# Altium project EDR_Project.PrjPcb
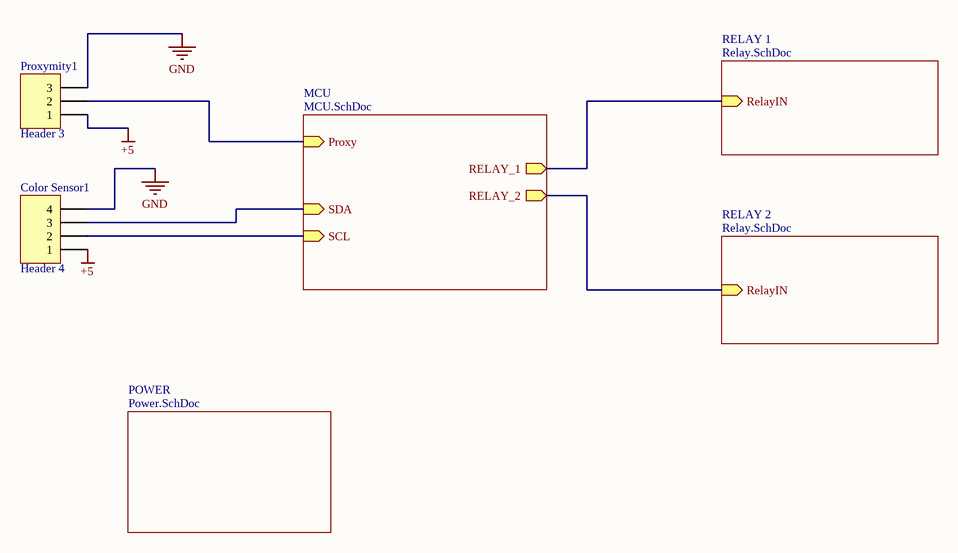
[diagram p0: main.SchDoc]
4 sheets, 27 parts. Net scope: hierarchical (ports join the sheet entries above them; power ports are global).
Sheets:
  main.SchDoc
    MCU = MCU.SchDoc
    RELAY 1 = Relay.SchDoc
    RELAY 2 = Relay.SchDoc
    POWER = Power.SchDoc

## Sheet main.SchDoc
size A; SheetNumber: 1; SheetTotal: 4

### Parts
Color_Sensor1  Header 4  [HDR1X4]
Proxymity1  Header 3  [HDR1X3]

### Sub-sheets
MCU = MCU.SchDoc: RELAY_2 (out), RELAY_1 (out), SDA (in), Proxy (in), SCL (in)
POWER = Power.SchDoc: no entries
RELAY 1 = Relay.SchDoc: RelayIN (in)
RELAY 2 = Relay.SchDoc: RelayIN (in)

### Nets
+5: Color_Sensor1.1 Proxymity1.1
GND: Color_Sensor1.4 Proxymity1.3
NetColor_Sensor1_2: Color_Sensor1.2 ; sheet MCU/SCL
NetColor_Sensor1_3: Color_Sensor1.3 ; sheet MCU/SDA
NetIC1_12: sheet MCU/RELAY_1, sheet RELAY 1/RelayIN
NetIC1_13: sheet MCU/RELAY_2, sheet RELAY 2/RelayIN
NetIC1_24: Proxymity1.2 ; sheet MCU/Proxy

### Library data of the parts
Color_Sensor1 = Header 4: Header, 4-Pin; LatestRevisionDate: 17-Jul-2002; LatestRevisionNote: Re-released for DXP Platform.; Publisher: Altium Limited
Proxymity1 = Header 3: Header, 3-Pin; LatestRevisionDate: 17-Jul-2002; LatestRevisionNote: Re-released for DXP Platform.; Publisher: Altium Limited

## Sheet MCU.SchDoc
size A; SheetNumber: 2; SheetTotal: 4
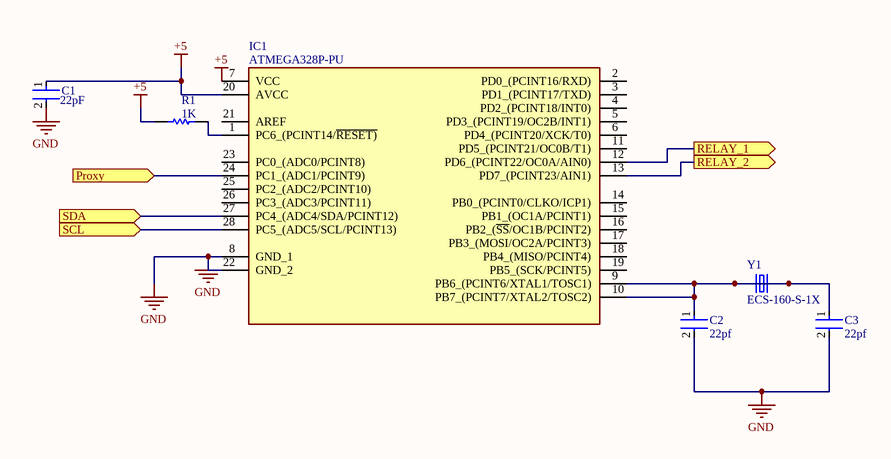
[diagram p1: MCU.SchDoc]

### Parts
C1  22pf  [FP-VY2472M49Y5UG63V7-MFG]
C2  22pf  [FP-VY2472M49Y5UG63V7-MFG]
C3  22pf  [FP-VY2472M49Y5UG63V7-MFG]
IC1  ATMEGA328P-PU  [DIP794W53P254L3467H457Q28N]
R1  1K  [RESA60-630X240]
Y1  ECS-160-S-1X  [XTAL_ECS-160-S-1X]

### Ports
Proxy (in), RELAY_1 (out), RELAY_2 (out), SCL (in), SDA (in)

### Nets
+5: C1.1 IC1.7(VCC) IC1.20(AVCC) R1.1
GND: C1.2 C2.2 C3.2 IC1.8(GND_1) IC1.22(GND_2)
NetC2_1: C2.1 C3.1 IC1.9(PB6_(PCINT6/XTAL1/TOSC1)) IC1.10(PB7_(PCINT7/XTAL2/TOSC2)) Y1.1 Y1.2
NetColor_Sensor1_2: IC1.28(PC5_(ADC5/SCL/PCINT13)) ; port SCL
NetColor_Sensor1_3: IC1.27(PC4_(ADC4/SDA/PCINT12)) ; port SDA
NetIC1_1: IC1.1(PC6_(PCINT14/~{RESET)}) R1.2
NetIC1_12: IC1.12(PD6_(PCINT22/OC0A/AIN0)) ; port RELAY_1
NetIC1_13: IC1.13(PD7_(PCINT23/AIN1)) ; port RELAY_2
NetIC1_24: IC1.24(PC1_(ADC1/PCINT9)) ; port Proxy

Not connected (* = marked no-connect by the designer): IC1 2(PD0_(PCINT16/RXD)) 3(PD1_(PCINT17/TXD)) 4(PD2_(PCINT18/INT0)) 5(PD3_(PCINT19/OC2B/INT1)) 6(PD4_(PCINT20/XCK/T0)) 11(PD5_(PCINT21/OC0B/T1)) 14(PB0_(PCINT0/CLKO/ICP1)) 15(PB1_(OC1A/PCINT1)) 16(PB2_(~{SS}/OC1B/PCINT2)) 17(PB3_(MOSI/OC2A/PCINT3)) 18(PB4_(MISO/PCINT4)) 19(PB5_(SCK/PCINT5)) 21(AREF) 23(PC0_(ADC0/PCINT8)) 25(PC2_(ADC2/PCINT10)) 26(PC3_(ADC3/PCINT11))

### Library data of the parts
C1-C3 = CMP-02417-000047-1: Capacitor Ceramic 4700pF ±20% Y5U BULK RADIAL; Lead/Base Style: Kinked; Capacitance: 4.7nF; Voltage Rating (DC): 300V; Body Diameter: 12.5mm; Lead Diameter: 0.6mm; Dissipation Factor: 2.5%; Mount: Through Hole; Package Quantity: 1000; Packaging: Bulk; Case/Package: Radial; Resistor Type: Ceramic; Termination: Radial; Series: VY2; Dielectric: Y5U; RoHS Compliant: Yes; Weight: 0.040932oz; Height - Seated (Max): 0.65inch; Tolerance: 20%; Lead Pitch: 7.5mm; REACH SVHC: No SVHC; Voltage Rating: 300V; Thickness: 5mm; Diameter: 12.5mm; Voltage Rating (AC): 300V; Max Operating Temperature: 125°C; Min Operating Temperature: -40°C
  C1: value: 22pF
IC1 = ATMEGA328P-PU: Integrated Circuit; Manufacturer_Name: Microchip; Datasheet Link: https://www.mouser.ca/datasheet/2/268/ATmega48A_PA_88A_PA_168A_PA_328_P_DS_DS40002061B-3050139.pdf; Height: 4.572mm; Manufacturer_Part_Number: ATMEGA328P-PU; Mouser Part Number: 556-ATMEGA328P-PU; Mouser Price/Stock: https://www.mouser.co.uk/ProductDetail/Microchip-Technology/ATMEGA328P-PU?qs=K8BHR703ZXguOQv3sKbWcg%3D%3D; Arrow Part Number: ATMEGA328P-PU; Arrow Price/Stock: https://www.arrow.com/en/products/atmega328p-pu/microchip-technology?region=europe
R1 = CMP-1659-00074-2: Axial Resistor, 10 KOhm, +/- 1%, 0.25 W, -55 to 155 degC, 2-Pin THD, RoHS, Bulk; Manufacturer: Yageo; Temperature Coefficient: 100ppm\/degreesC; Voltage Rating: 250V; Voltage Rating (DC): 200V; Resistance: 1KOhm; Max Power Dissipation: 250mW; Datasheet URL: http://www.yageo.com/documents/recent/Yageo%20LR_MFR_2013.pdf; Packaging: Bulk; RoHSCompliant: True; Mount: ThroughHole; Package Reference: MFR-25; Termination: Axial; Composition: MetalFilm; Number of Terminations: 2; Package Quantity: 200; Mounting Technology: ThroughHole; Length: 0.248inch; Max Operating Temperature: 155degC; Min Operating Temperature: -55degC; Datasheet Version: 04/2013; Lead Free: LeadFree; Manufacturer URL: http://www.yageo.com/; Tolerance: 1%; Power Rating: 250mW; Package Description: 2-Pin Axial Lead, Dia 2.4 mm, Body Length 6.3 mm; Military Standard: Not; Case\/Package: Axial
Y1 = ECS-160-S-1X: 16MHz Â±30ppm Crystal Series 20 Ohms HC-49/U; MF: ECS Inc.; Value: *; MP: ECS-160-S-1X; SnapEDA_Link: https://www.snapeda.com/parts/ECS-160-S-1X/ECS%20Inc./view-part/2458894/?ref=snap; Availability: Unavailable; Package: HC49/U ECS International; Price: None

## Sheet Relay.SchDoc
size A; SheetNumber: 4; SheetTotal: 4
Used 2 times, as channels RELAY 1, RELAY 2. Parts and nets are listed once, with the designators drawn on the sheet.
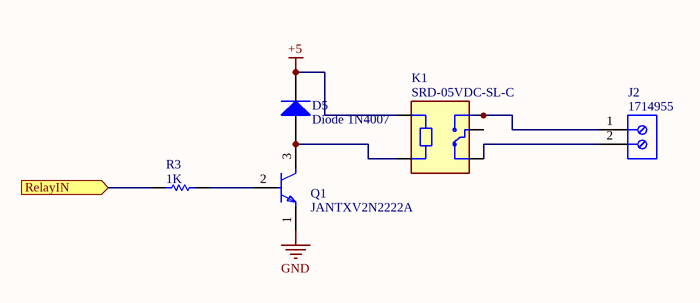
[diagram p2: Relay.SchDoc]

### Parts
D5  Diode 1N4007  [DO-41]
J2  1714955  [PHOE-1714955_V]
K1  SRD-05VDC-SL-C  [RELAY_SRD-05VDC-SL-C]
Q1  JANTXV2N2222A  [FP-TO-18-MFG]
R3  1K  [RESA60-630X240]

### Ports
RelayIN (in)

### Nets
+5: D5.2(K) K1.A1
GND: Q1.1(E)
RelayIN: R3.1 ; port RelayIN
NetD5_1: D5.1(A) K1.A2 Q1.3(C)
NetJ2_1: J2.1 K1.NO
NetJ2_2: J2.2 K1.NC
NetQ1_2: Q1.2(B) R3.2

Not connected (* = marked no-connect by the designer): K1 COM

### Channels
RELAY 1: designators end in _RELAY_1; ports RelayIN=NetIC1_12
RELAY 2: designators end in _RELAY_2; ports RelayIN=NetIC1_13

### Library data of the parts
D5 = Diode 1N4007: 1 Amp General Purpose Rectifier; Published: 8-Jun-2000; LatestRevisionDate: 17-Jul-2002; LatestRevisionNote: Re-released for DXP Platform.; DatasheetVersion: 1998; PackageVersion: Aug-1999; PackageReference: DO-41; Publisher: Altium Limited; PackageDescription: Diode, Axial; Body 5.2 x 2.7 mm (LxDia. max), Lead Dia. 0.86 mm (max); Code_JEDEC: DO-204-AL; ComponentLink1Description: Manufacturer Link; ComponentLink1URL: http://www.fairchildsemi.com/; ComponentLink2Description: Datasheet; ComponentLink2URL: http://www.fairchildsemi.com/ds/1N%2F1N4001.pdf
J2 = CMP-2000-05797-1: PC Terminal Block, Pitch 6.35 mm, 1 x 2 Position, Height 21.5 mm, Tail Lenght 5.1 mm, RoHS, Bulk; Manufacturer: Phoenix Contact; Package Description: PC Terminal Block, Pitch 6.35 mm, 1 x 2 Position, Height 21.5 mm, Tail Lenght 5.1 mm; Datasheet URL: http://media.digikey.com/pdf/Data%20Sheets/Phoenix%20Contact%20PDFs/1714955.pdf; Package Reference: 1714955; Manufacturer URL: http://www.phoenixcontact.com/; Datasheet Version: 02/2010; Mounting Technology: ThroughHole
K1 = SRD-05VDC-SL-C: 5V Trigger Relay Module For Arduino And Raspberry Pi 5V Trigger Relay Module For Arduino And Raspberry Pi; MF: Songle Relay; Check_prices: https://www.snapeda.com/parts/SRD-05VDC-SL-C/Songle+Relay/view-part/?ref=eda; Value: *; Availability: Not in stock; Price: None; Package: NON STANDARD-5 Songle Relay; MP: SRD-05VDC-SL-C; SnapEDA_Link: https://www.snapeda.com/parts/SRD-05VDC-SL-C/Songle+Relay/view-part/?ref=snap
Q1 = CMP-00252-09163452-1: JANTXV2N2222A Small Signal Bipolar Transistor, 0.8A I(C), 50V V(BR)CEO, 1-Element, NPN, Silicon, TO-206AA; Max Power Dissipation: 500mW; Max Collector Current: 800mA; Number of Elements: 1; Collector Base Voltage (VCBO): 75V; Emitter Base Voltage (VEBO): 6V; Lifecycle Status: Production; NexarPartId: 9163452; Max Operating Temperature: 200°C; Power Dissipation: 500mW; Min Operating Temperature: -65°C; Packaging: Bulk; Collector Emitter Breakdown Voltage: 50V; Collector Emitter Voltage (VCEO): 50V; Polarity: NPN; Radiation Hardening: No; Schedule B: 8541210080; Mount: Through Hole; RoHS: Compliant; Case/Package: TO-18; Lead Free: Contains Lead; Number of Pins: 3
R3 = CMP-1659-00074-2: as R1 on sheet MCU; Datasheet URL: http://www.yageo.com/documents/recent/Yageo%20LR_MFR_2013.pdf; Packaging: Bulk; RoHSCompliant: True; Mount: ThroughHole; Package Reference: MFR-25; Termination: Axial; Composition: MetalFilm; Number of Terminations: 2; Package Quantity: 200; Mounting Technology: ThroughHole; Length: 0.248inch; Max Operating Temperature: 155degC; Min Operating Temperature: -55degC; Datasheet Version: 04/2013; Lead Free: LeadFree; Manufacturer URL: http://www.yageo.com/; Tolerance: 1%; Power Rating: 250mW; Package Description: 2-Pin Axial Lead, Dia 2.4 mm, Body Length 6.3 mm; Military Standard: Not; Case\/Package: Axial

## Sheet Power.SchDoc
size A; SheetNumber: 3; SheetTotal: 4
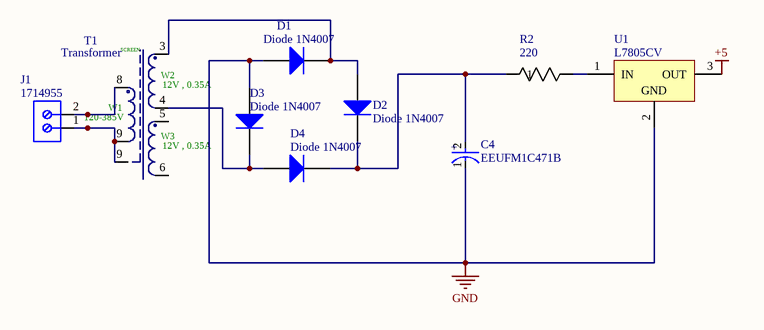
[diagram p3: Power.SchDoc]

### Parts
C4  EEUFM1C471B  [FP-RAD-TH-D_10_0_5-L_12_5-MFG]
D1  Diode 1N4007  [DO-41]
D2  Diode 1N4007  [DO-41]
D3  Diode 1N4007  [DO-41]
D4  Diode 1N4007  [DO-41]
J1  1714955  [PHOE-1714955_V]
R2  220  [RES_AC01_VIS]
T1  Transformer  [EE16_7_4 (E16)]
U1  L7805CV  [TO220]

### Nets
+5: U1.3(OUT)
GND: C4.1(C) D1.1(A) D3.1(A) U1.2(GND)
NetC4_2: C4.2(A) D2.2(K) D4.2(K) R2.1
NetD1_2: D1.2(K) D2.1(A) T1.3
NetD3_2: D3.2(K) D4.1(A) T1.4
NetJ1_1: J1.1 T1.9
NetJ1_2: J1.2 T1.8
NetR2_2: R2.2 U1.1(IN)

Not connected (* = marked no-connect by the designer): T1 5 6

### Notes on the sheet
- (in symbol CMP-1471-00001-1) SCREEN; W2; 12V , 0.35A; W1; 120-385V; W3
- (in symbol CMP-05427-001980-1) +

### Library data of the parts
C4 = CMP-05427-001980-1: Aluminum Electrolytic Capacitors (Radial Lead Type) 470uF ±20% 16V; Ripple Current: 1.29A; ESR (Equivalent Series Resistance): 38mR; Life (Hours): 4000Hour; Lead Diameter: 0.6mm; Height: 12.5mm; Package Quantity: 500; Lead Free: Lead Free; Voltage Rating: 16V; Diameter: 10mm; Radiation Hardening: No; Packaging: Tape and Reel; Case/Package: Radial; Tolerance: 20%; Series: FM; Capacitance: 470uF; Height - Seated (Max): 0.551inch; Max Operating Temperature: 105°C; Termination: Radial; Mount: Through Hole; RoHS Compliant: Yes; Voltage Rating (DC): 16V; Impedance: 38mR; Length: 12.5mm; Lead Pitch: 5mm; Min Operating Temperature: -40°C
D1-D4 = Diode 1N4007: 1 Amp General Purpose Rectifier; Published: 8-Jun-2000; LatestRevisionDate: 17-Jul-2002; LatestRevisionNote: Re-released for DXP Platform.; DatasheetVersion: 1998; PackageVersion: Aug-1999; PackageReference: DO-41; Publisher: Altium Limited; PackageDescription: Diode, Axial; Body 5.2 x 2.7 mm (LxDia. max), Lead Dia. 0.86 mm (max); Code_JEDEC: DO-204-AL; ComponentLink1Description: Manufacturer Link; ComponentLink1URL: http://www.fairchildsemi.com/; ComponentLink2Description: Datasheet; ComponentLink2URL: http://www.fairchildsemi.com/ds/1N%2F1N4001.pdf
J1 = CMP-2000-05797-1: as J2 on sheet Relay; Package Description: PC Terminal Block, Pitch 6.35 mm, 1 x 2 Position, Height 21.5 mm, Tail Lenght 5.1 mm; Datasheet URL: http://media.digikey.com/pdf/Data%20Sheets/Phoenix%20Contact%20PDFs/1714955.pdf; Package Reference: 1714955; Manufacturer URL: http://www.phoenixcontact.com/; Datasheet Version: 02/2010; Mounting Technology: ThroughHole
R2 = CMP-00030-39747107-1: AC01000006809JA100 Resistor, 68 Ohm, ± 5%, 1 W, Axial Leaded, Wirewound, General Purpose; Resistance: 68Ω; Max Power Dissipation: 1W; Lead Diameter: 800µm; Temperature Coefficient: 180ppm/°C; Voltage Rating (DC): 8V; Min Operating Temperature: -40°C; Tolerance: 5%; Max Operating Temperature: 275°C; Contact Plating: Tin; Diameter: 4.3mm; Power Rating: 1W; RoHS: Compliant; Packaging: Tape & Box (TB); Length: 11mm; REACH SVHC: Unknown; NexarPartId: 39747107; Number of Terminations: 2; Composition: Wirewound; Features: Flame Retardant Coating; Number of Pins: 2; Termination: Axial; Schedule B: 8533210080, 8533210080; Case/Package: Axial
T1 = CMP-1471-00001-1: Off-Line Transformer WE-UNIT , L=0.9mH; Manufacturer: Wuerth Elektronik; PartNumber: 7491182012; Turns Ratio: "9.5","1:1"; Inductance: 0.9mH; Output Voltage (DC): 12; Output Current (A): 0.6; Input Voltage (AC): 85-265; ComponentLink1Description: Manufacturer URL; ComponentLink1URL: http://www.we-online.com; PackageReference: EE16_7_4 (E16); ComponentLink2Description: Datasheet; ComponentLink2URL: http://www.we-online.de/katalog/media/pdf/7491182012.pdf
U1 = CMP-0244-00483-1: Positive Voltage Regulator, 5V, 3-Pin TO-220; PackageDescription: TO, Thru-Hole, Vertical, Heatsink Mounted; 3 In-Line Leads; Pitch 2.54 mm; ComponentLink2Description: Datasheet; PackageReference: TO220; ComponentLink3URL: http://www.st.com/internet/com/TECHNICAL_RESOURCES/TECHNICAL_LITERATURE/PACKAGE_INFORMATION/CD00004649.pdf; DatasheetVersion: 16/11/2011; ComponentLink1Description: Manufacturer URL; ComponentLink1URL: http://www.st.com; PackageVersion: ver3.0; ComponentLink3Description: Package Specification; ComponentLink2URL: http://www.st.com/internet/com/TECHNICAL_RESOURCES/TECHNICAL_LITERATURE/DATASHEET/CD00000444.pdf

## Nets that join several sheets
+5: main (Color_Sensor1.1 Proxymity1.1), MCU (C1.1 IC1.7 IC1.20 R1.1), RELAY 1 (D5_RELAY_1.2 K1_RELAY_1.A1), RELAY 2 (D5_RELAY_2.2 K1_RELAY_2.A1), Power (U1.3)
GND: main (Color_Sensor1.4 Proxymity1.3), MCU (5 pins), RELAY 1 (Q1_RELAY_1.1), RELAY 2 (Q1_RELAY_2.1), Power (C4.1 D1.1 D3.1 U1.2)
NetColor_Sensor1_2: main (Color_Sensor1.2), MCU (IC1.28)
NetColor_Sensor1_3: main (Color_Sensor1.3), MCU (IC1.27)
NetIC1_12: MCU (IC1.12), RELAY 1 (R3_RELAY_1.1)
NetIC1_13: MCU (IC1.13), RELAY 2 (R3_RELAY_2.1)
NetIC1_24: main (Proxymity1.2), MCU (IC1.24)